# Altium schematic sheet paddles.SchDoc
size A4
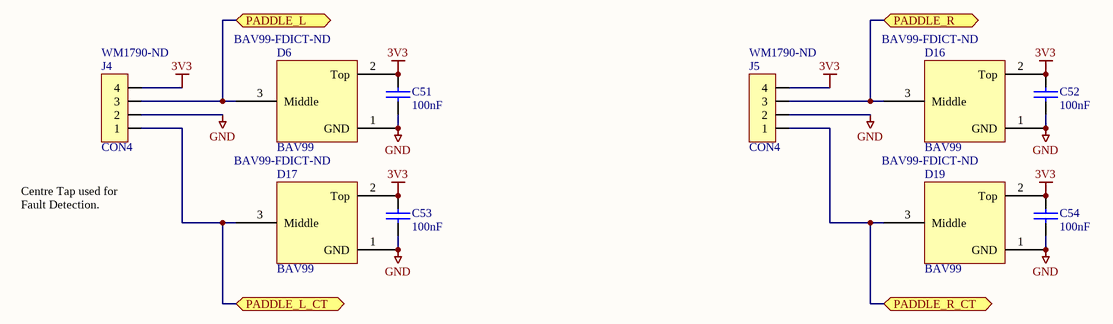
[diagram p0: paddles.SchDoc]

## Parts
C51  100nF  [0603]
C52  100nF  [0603]
C53  100nF  [0603]
C54  100nF  [0603]
D6  BAV99  Supplier Part Number 1: BAV99-FDICT-ND  [SOT23-3]
D16  BAV99  Supplier Part Number 1: BAV99-FDICT-ND  [SOT23-3]
D17  BAV99  Supplier Part Number 1: BAV99-FDICT-ND  [SOT23-3]
D19  BAV99  Supplier Part Number 1: BAV99-FDICT-ND  [SOT23-3]
J4  CON4  Supplier Part Number 1: WM1790-ND  [MICROFIT-4-VERT]
J5  CON4  Supplier Part Number 1: WM1790-ND  [MICROFIT-4-VERT]

## Ports
PADDLE_L, PADDLE_L_CT, PADDLE_R, PADDLE_R_CT

## Nets
3V3: C51.1 C52.1 C53.1 C54.1 D6.2(Top) D16.2(Top) D17.2(Top) D19.2(Top) J4.4 J5.4
GND: C51.2 C52.2 C53.2 C54.2 D6.1(GND) D16.1(GND) D17.1(GND) D19.1(GND) J4.2 J5.2
PADDLE_L: D6.3(Middle) J4.3 ; port PADDLE_L
PADDLE_L_CT: D17.3(Middle) J4.1 ; port PADDLE_L_CT
PADDLE_R: D16.3(Middle) J5.3 ; port PADDLE_R
PADDLE_R_CT: D19.3(Middle) J5.1 ; port PADDLE_R_CT

## Notes on the sheet
- Centre Tap used for Fault Detection.

## Library data of the parts
C51-C54 = CAP: Capacitor; Farnell: 753-567; Price: 0.31
D6 D16 D17 D19 = BAV99: Dual Diode; Manufacturer: Diodes Inc; Manufacturer Part Number: BAV99-7-F; Description: DIODE ARRAY 75V 300MA SOT23; Voltage - Forward (Vf) (Max) @ If: 1.25V @ 150mA; Current - Reverse Leakage @ Vr: 2.5µA @ 75V; Current - Average Rectified (Io) (per Diode): 300mA (DC); Voltage - DC Reverse (Vr) (Max): 75V; Reverse Recovery Time (trr): 4ns; Diode Type: Standard; Speed: Fast Recovery =< 500ns, > 200mA (Io); Diode Configuration: 1 Pair Series Connection; Supplier 1: Digi-Key; RoHS: RoHS Compliant; Category: Discrete Semiconductor Products; Stock 1: 234004; Pricing 1: 1=0.18, 10=0.171, 25=0.1548, 100=0.1114, 250=0.0656, 500=0.05444, 1000=0.03714 (AUD); Packaging: Cut Tape (CT); Mounting Type: Surface Mount; Package / Case: TO-236-3, SC-59, SOT-23-3; Supplier Device Package: SOT-23-3; ComponentLink1URL: http://www.diodes.com/datasheets/ds12007.pdf; ComponentLink1Description: http://www.diodes.com/datasheets/ds12007.pdf
J4 J5 = CON4: Connector; Manufacturer: Molex Inc; Manufacturer Part Number: 0430450412; Description: CONN HEADER 4POS 3MM VERT TIN; Connector Type: Header, Shrouded; Number of Positions: 4; Number of Positions Loaded: All; Pitch: 0.118" (3.00mm); element14: http://au.element14.com/molex/43045-0412/header-vertical-4way/dp/1012247; Supplier 1: Digi-Key; RoHS: RoHS Compliant; Category: Connectors, Interconnects; Stock 1: 6691; Pricing 1: 1=1.38, 10=1.215, 50=1.0954, 100=1.0478, 250=0.95256, 500=0.85728, 1000=0.76204, 2500=0.6906, 5000=0.66678 (AUD); Packaging: Tray; Contact Type: Male Pin; Number of Rows: 2; Row Spacing: 0.118" (3.00mm); Contact Mating Length: -; Mounting Type: Through Hole; Termination: Press-Fit; Fastening Type: Locking Ramp; Features: Board Guide; Contact Finish: Tin; Contact Finish Thickness: 100µin (2.54µm); Color: Black; ComponentLink1URL: http://www.molex.com/pdm_docs/sd/430450412_sd.pdf; ComponentLink1Description: http://www.molex.com/pdm_docs/sd/430450412_sd.pdf